# EAGLE schematic cmv12k-adapter-v1.2 (EAGLE 6.5.0)
I2C Bus Components - Dual DAC - Voltage Monitoring - Temperature Sensors - I/O Expander
VERSION: V1.2

## Sheet 1 of 3
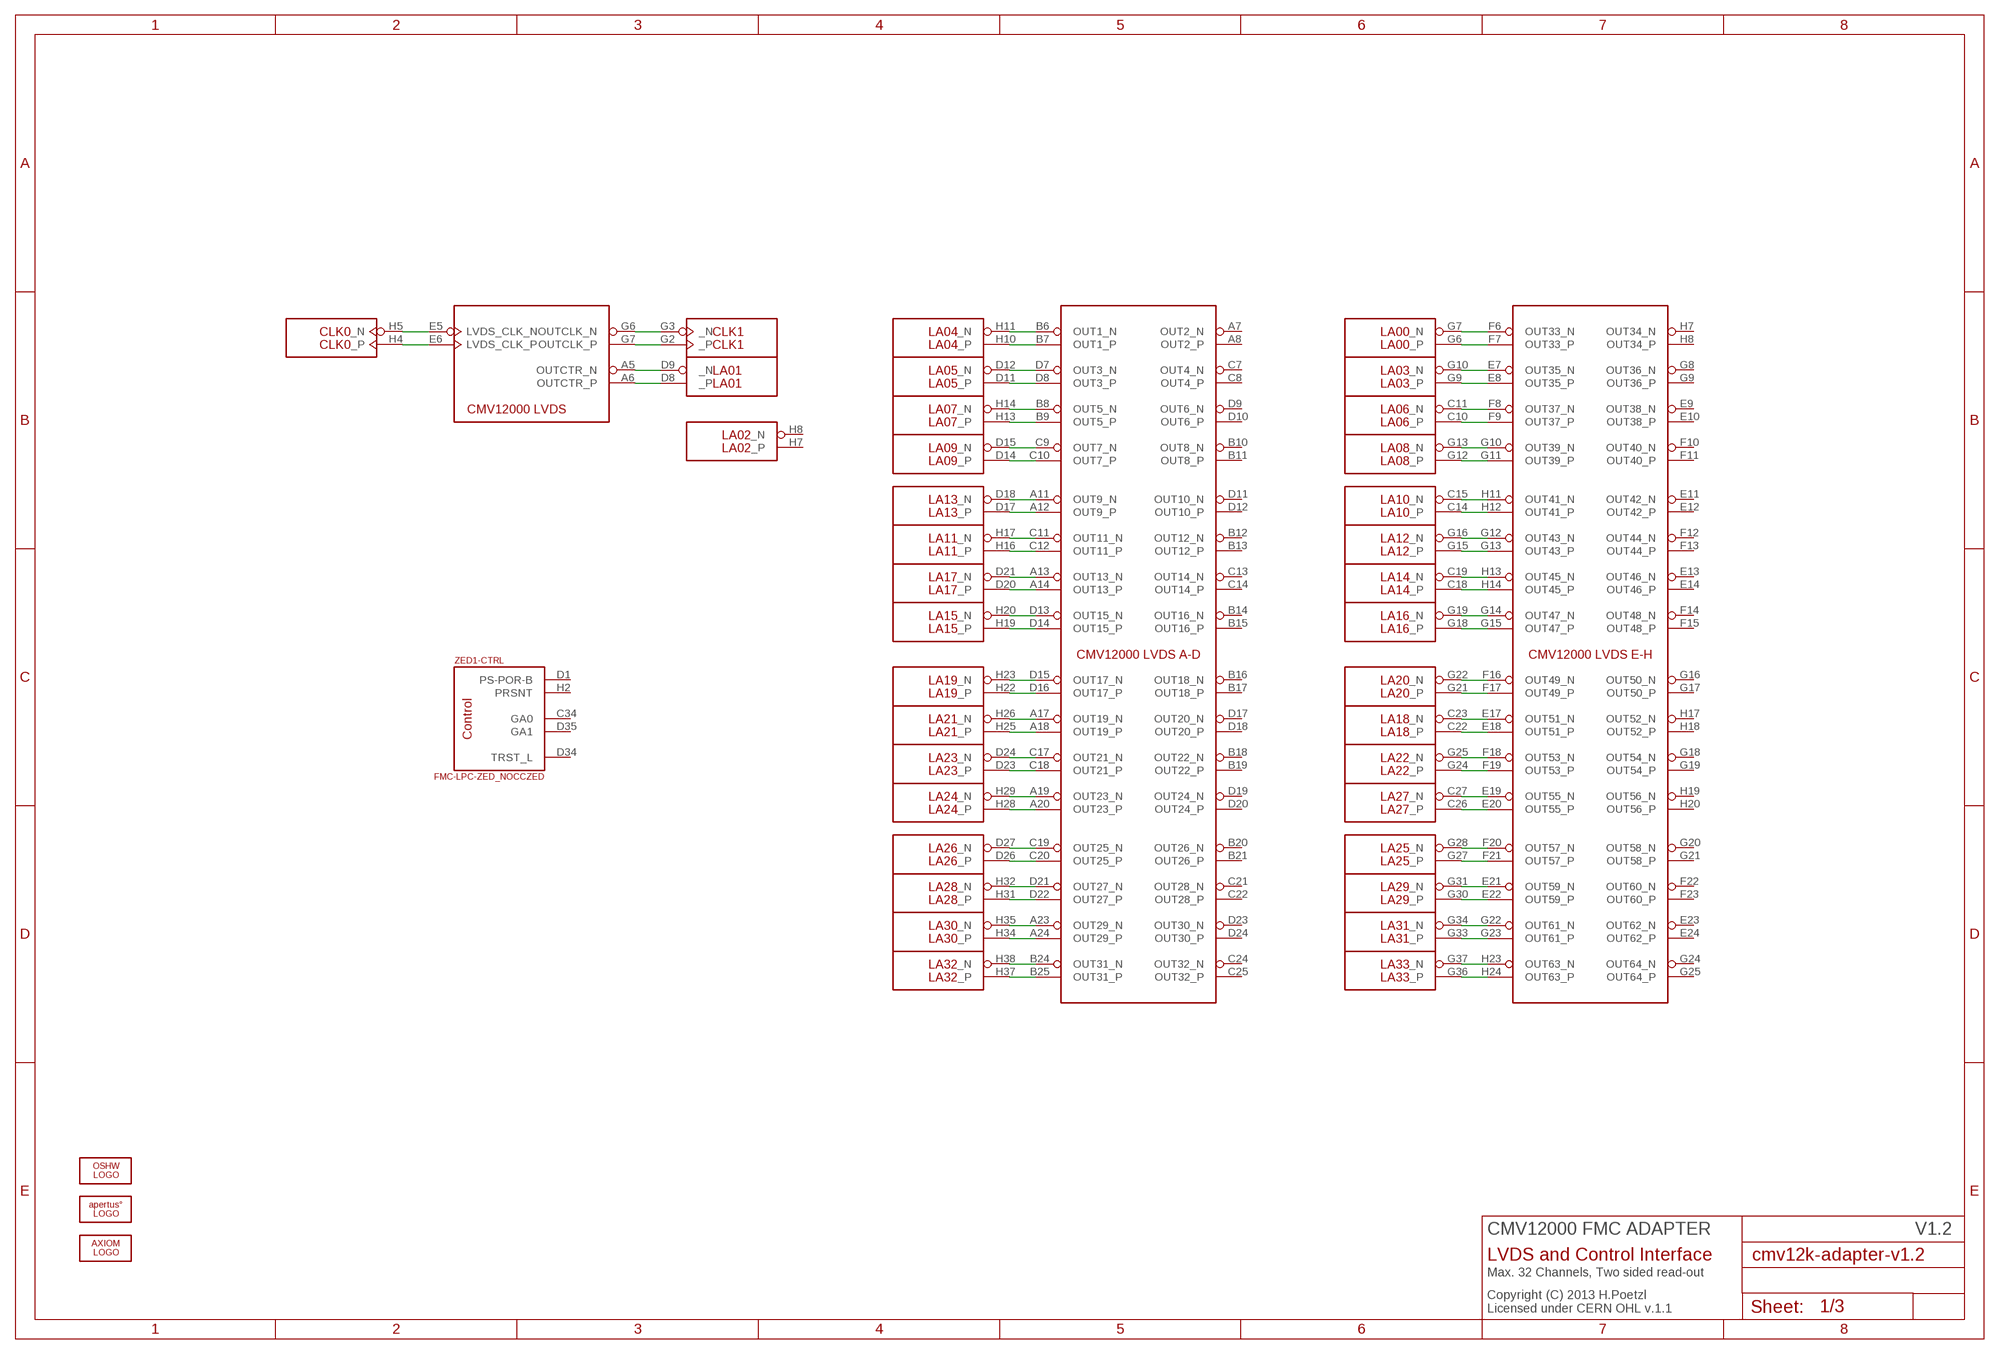
[diagram p0: schematic, sheet 1]

### Parts
LOGO1  OSHW_LOGO_FILLX0100-NT  [OSHW_FILLX100_NOTEXT]
SOCKET  CMV12000ANDON+LM  [10-30-07-237-400T4+LM]
U$5  APERTUS_LOGO334X100  [APERTUS_LOGO_334X100]
U$13  AXIOM_LOGO525X80  [AXIOM_LOGO_525X80]
ZED1  FMC-LPC-ZED_NOCCZED  [ASP-134604-01-ZED]

### Nets
CLK0_N: SOCKET.E5(LVDS_CLK_N) ZED1.H5(CLK0:_N)
CLK0_P: SOCKET.E6(LVDS_CLK_P) ZED1.H4(CLK0:_P)
CLK1_N: SOCKET.G6(OUTCLK_N) ZED1.G3(CLK1:_N)
CLK1_P: SOCKET.G7(OUTCLK_P) ZED1.G2(CLK1:_P)
LA00_N: SOCKET.F6(OUT33_N) ZED1.G7(LA00:_N)
LA00_P: SOCKET.F7(OUT33_P) ZED1.G6(LA00:_P)
LA01_N: SOCKET.A5(OUTCTR_N) ZED1.D9(LA01:_N)
LA01_P: SOCKET.A6(OUTCTR_P) ZED1.D8(LA01:_P)
LA03_N: SOCKET.E7(OUT35_N) ZED1.G10(LA03:_N)
LA03_P: SOCKET.E8(OUT35_P) ZED1.G9(LA03:_P)
LA04_N: SOCKET.B6(OUT1_N) ZED1.H11(LA04:_N)
LA04_P: SOCKET.B7(OUT1_P) ZED1.H10(LA04:_P)
LA05_N: SOCKET.D7(OUT3_N) ZED1.D12(LA05:_N)
LA05_P: SOCKET.D8(OUT3_P) ZED1.D11(LA05:_P)
LA06_N: SOCKET.F8(OUT37_N) ZED1.C11(LA06:_N)
LA06_P: SOCKET.F9(OUT37_P) ZED1.C10(LA06:_P)
LA07_N: SOCKET.B8(OUT5_N) ZED1.H14(LA07:_N)
LA07_P: SOCKET.B9(OUT5_P) ZED1.H13(LA07:_P)
LA08_N: SOCKET.G10(OUT39_N) ZED1.G13(LA08:_N)
LA08_P: SOCKET.G11(OUT39_P) ZED1.G12(LA08:_P)
LA09_N: SOCKET.C9(OUT7_N) ZED1.D15(LA09:_N)
LA09_P: SOCKET.C10(OUT7_P) ZED1.D14(LA09:_P)
LA10_N: SOCKET.H11(OUT41_N) ZED1.C15(LA10:_N)
LA10_P: SOCKET.H12(OUT41_P) ZED1.C14(LA10:_P)
LA11_N: SOCKET.C11(OUT11_N) ZED1.H17(LA11:_N)
LA11_P: SOCKET.C12(OUT11_P) ZED1.H16(LA11:_P)
LA12_N: SOCKET.G12(OUT43_N) ZED1.G16(LA12:_N)
LA12_P: SOCKET.G13(OUT43_P) ZED1.G15(LA12:_P)
LA13_N: SOCKET.A11(OUT9_N) ZED1.D18(LA13:_N)
LA13_P: SOCKET.A12(OUT9_P) ZED1.D17(LA13:_P)
LA14_N: SOCKET.H13(OUT45_N) ZED1.C19(LA14:_N)
LA14_P: SOCKET.H14(OUT45_P) ZED1.C18(LA14:_P)
LA15_N: SOCKET.D13(OUT15_N) ZED1.H20(LA15:_N)
LA15_P: SOCKET.D14(OUT15_P) ZED1.H19(LA15:_P)
LA16_N: SOCKET.G14(OUT47_N) ZED1.G19(LA16:_N)
LA16_P: SOCKET.G15(OUT47_P) ZED1.G18(LA16:_P)
LA17_N: SOCKET.A13(OUT13_N) ZED1.D21(LA17:_N)
LA17_P: SOCKET.A14(OUT13_P) ZED1.D20(LA17:_P)
LA18_N: SOCKET.E17(OUT51_N) ZED1.C23(LA18:_N)
LA18_P: SOCKET.E18(OUT51_P) ZED1.C22(LA18:_P)
LA19_N: SOCKET.D15(OUT17_N) ZED1.H23(LA19:_N)
LA19_P: SOCKET.D16(OUT17_P) ZED1.H22(LA19:_P)
LA20_N: SOCKET.F16(OUT49_N) ZED1.G22(LA20:_N)
LA20_P: SOCKET.F17(OUT49_P) ZED1.G21(LA20:_P)
LA21_N: SOCKET.A17(OUT19_N) ZED1.H26(LA21:_N)
LA21_P: SOCKET.A18(OUT19_P) ZED1.H25(LA21:_P)
LA22_N: SOCKET.F18(OUT53_N) ZED1.G25(LA22:_N)
LA22_P: SOCKET.F19(OUT53_P) ZED1.G24(LA22:_P)
LA23_N: SOCKET.C17(OUT21_N) ZED1.D24(LA23:_N)
LA23_P: SOCKET.C18(OUT21_P) ZED1.D23(LA23:_P)
LA24_N: SOCKET.A19(OUT23_N) ZED1.H29(LA24:_N)
LA24_P: SOCKET.A20(OUT23_P) ZED1.H28(LA24:_P)
LA25_N: SOCKET.F20(OUT57_N) ZED1.G28(LA25:_N)
LA25_P: SOCKET.F21(OUT57_P) ZED1.G27(LA25:_P)
LA26_N: SOCKET.C19(OUT25_N) ZED1.D27(LA26:_N)
LA26_P: SOCKET.C20(OUT25_P) ZED1.D26(LA26:_P)
LA27_N: SOCKET.E19(OUT55_N) ZED1.C27(LA27:_N)
LA27_P: SOCKET.E20(OUT55_P) ZED1.C26(LA27:_P)
LA28_N: SOCKET.D21(OUT27_N) ZED1.H32(LA28:_N)
LA28_P: SOCKET.D22(OUT27_P) ZED1.H31(LA28:_P)
LA29_N: SOCKET.E21(OUT59_N) ZED1.G31(LA29:_N)
LA29_P: SOCKET.E22(OUT59_P) ZED1.G30(LA29:_P)
LA30_N: SOCKET.A23(OUT29_N) ZED1.H35(LA30:_N)
LA30_P: SOCKET.A24(OUT29_P) ZED1.H34(LA30:_P)
LA31_N: SOCKET.G22(OUT61_N) ZED1.G34(LA31:_N)
LA31_P: SOCKET.G23(OUT61_P) ZED1.G33(LA31:_P)
LA32_N: SOCKET.B24(OUT31_N) ZED1.H38(LA32:_N)
LA32_P: SOCKET.B25(OUT31_P) ZED1.H37(LA32:_P)
LA33_N: SOCKET.H23(OUT63_N) ZED1.G37(LA33:_N)
LA33_P: SOCKET.H24(OUT63_P) ZED1.G36(LA33:_P)
Unconnected: SOCKET.A7(OUT2_N) SOCKET.A8(OUT2_P) SOCKET.B10(OUT8_N) SOCKET.B11(OUT8_P) SOCKET.B12(OUT12_N) SOCKET.B13(OUT12_P) SOCKET.B14(OUT16_N) SOCKET.B15(OUT16_P) SOCKET.B16(OUT18_N) SOCKET.B17(OUT18_P) SOCKET.B18(OUT22_N) SOCKET.B19(OUT22_P) SOCKET.B20(OUT26_N) SOCKET.B21(OUT26_P) SOCKET.C3(NC) SOCKET.C7(OUT4_N) SOCKET.C8(OUT4_P) SOCKET.C13(OUT14_N) SOCKET.C14(OUT14_P) SOCKET.C21(OUT28_N) SOCKET.C22(OUT28_P) SOCKET.C24(OUT32_N) SOCKET.C25(OUT32_P) SOCKET.D9(OUT6_N) SOCKET.D10(OUT6_P) SOCKET.D11(OUT10_N) SOCKET.D12(OUT10_P) SOCKET.D17(OUT20_N) SOCKET.D18(OUT20_P) SOCKET.D19(OUT24_N) SOCKET.D20(OUT24_P) SOCKET.D23(OUT30_N) SOCKET.D24(OUT30_P) SOCKET.E9(OUT38_N) SOCKET.E10(OUT38_P) SOCKET.E11(OUT42_N) SOCKET.E12(OUT42_P) SOCKET.E13(OUT46_N) SOCKET.E14(OUT46_P) SOCKET.E23(OUT62_N) SOCKET.E24(OUT62_P) SOCKET.F10(OUT40_N) SOCKET.F11(OUT40_P) SOCKET.F12(OUT44_N) SOCKET.F13(OUT44_P) SOCKET.F14(OUT48_N) SOCKET.F15(OUT48_P) SOCKET.F22(OUT60_N) SOCKET.F23(OUT60_P) SOCKET.F24(NC) SOCKET.F25(NC) SOCKET.G8(OUT36_N) SOCKET.G9(OUT36_P) SOCKET.G16(OUT50_N) SOCKET.G17(OUT50_P) SOCKET.G18(OUT54_N) SOCKET.G19(OUT54_P) SOCKET.G20(OUT58_N) SOCKET.G21(OUT58_P) SOCKET.G24(OUT64_N) SOCKET.G25(OUT64_P) SOCKET.H2(NC) SOCKET.H7(OUT34_N) SOCKET.H8(OUT34_P) SOCKET.H17(OUT52_N) SOCKET.H18(OUT52_P) SOCKET.H19(OUT56_N) SOCKET.H20(OUT56_P) ZED1.C2(-NC:C2M_P) ZED1.C3(-NC:C2M_N) ZED1.C6(-NC:M2C_P) ZED1.C7(-NC:M2C_N) ZED1.C34(-CTRL:GA0) ZED1.D1(-CTRL:PS-POR-B) ZED1.D4(-NC:CLK0-M2C_P) ZED1.D5(-NC:CLK0-M2C-N) ZED1.D29(-JTAG:TCK) ZED1.D30(-JTAG:TDI) ZED1.D31(-JTAG:TDO) ZED1.D33(-JTAG:TMS) ZED1.D34(-CTRL:TRST_L) ZED1.D35(-CTRL:GA1) ZED1.H2(-CTRL:PRSNT) ZED1.H7(LA02:_P) ZED1.H8(LA02:_N)

### Notes on the sheet
- CMV12000 FMC ADAPTER
- LVDS and Control Interface
- Max. 32 Channels, Two sided read-out
- Copyright (C) 2013 H.Poetzl
  Licensed under CERN OHL v.1.1

## Sheet 2 of 3
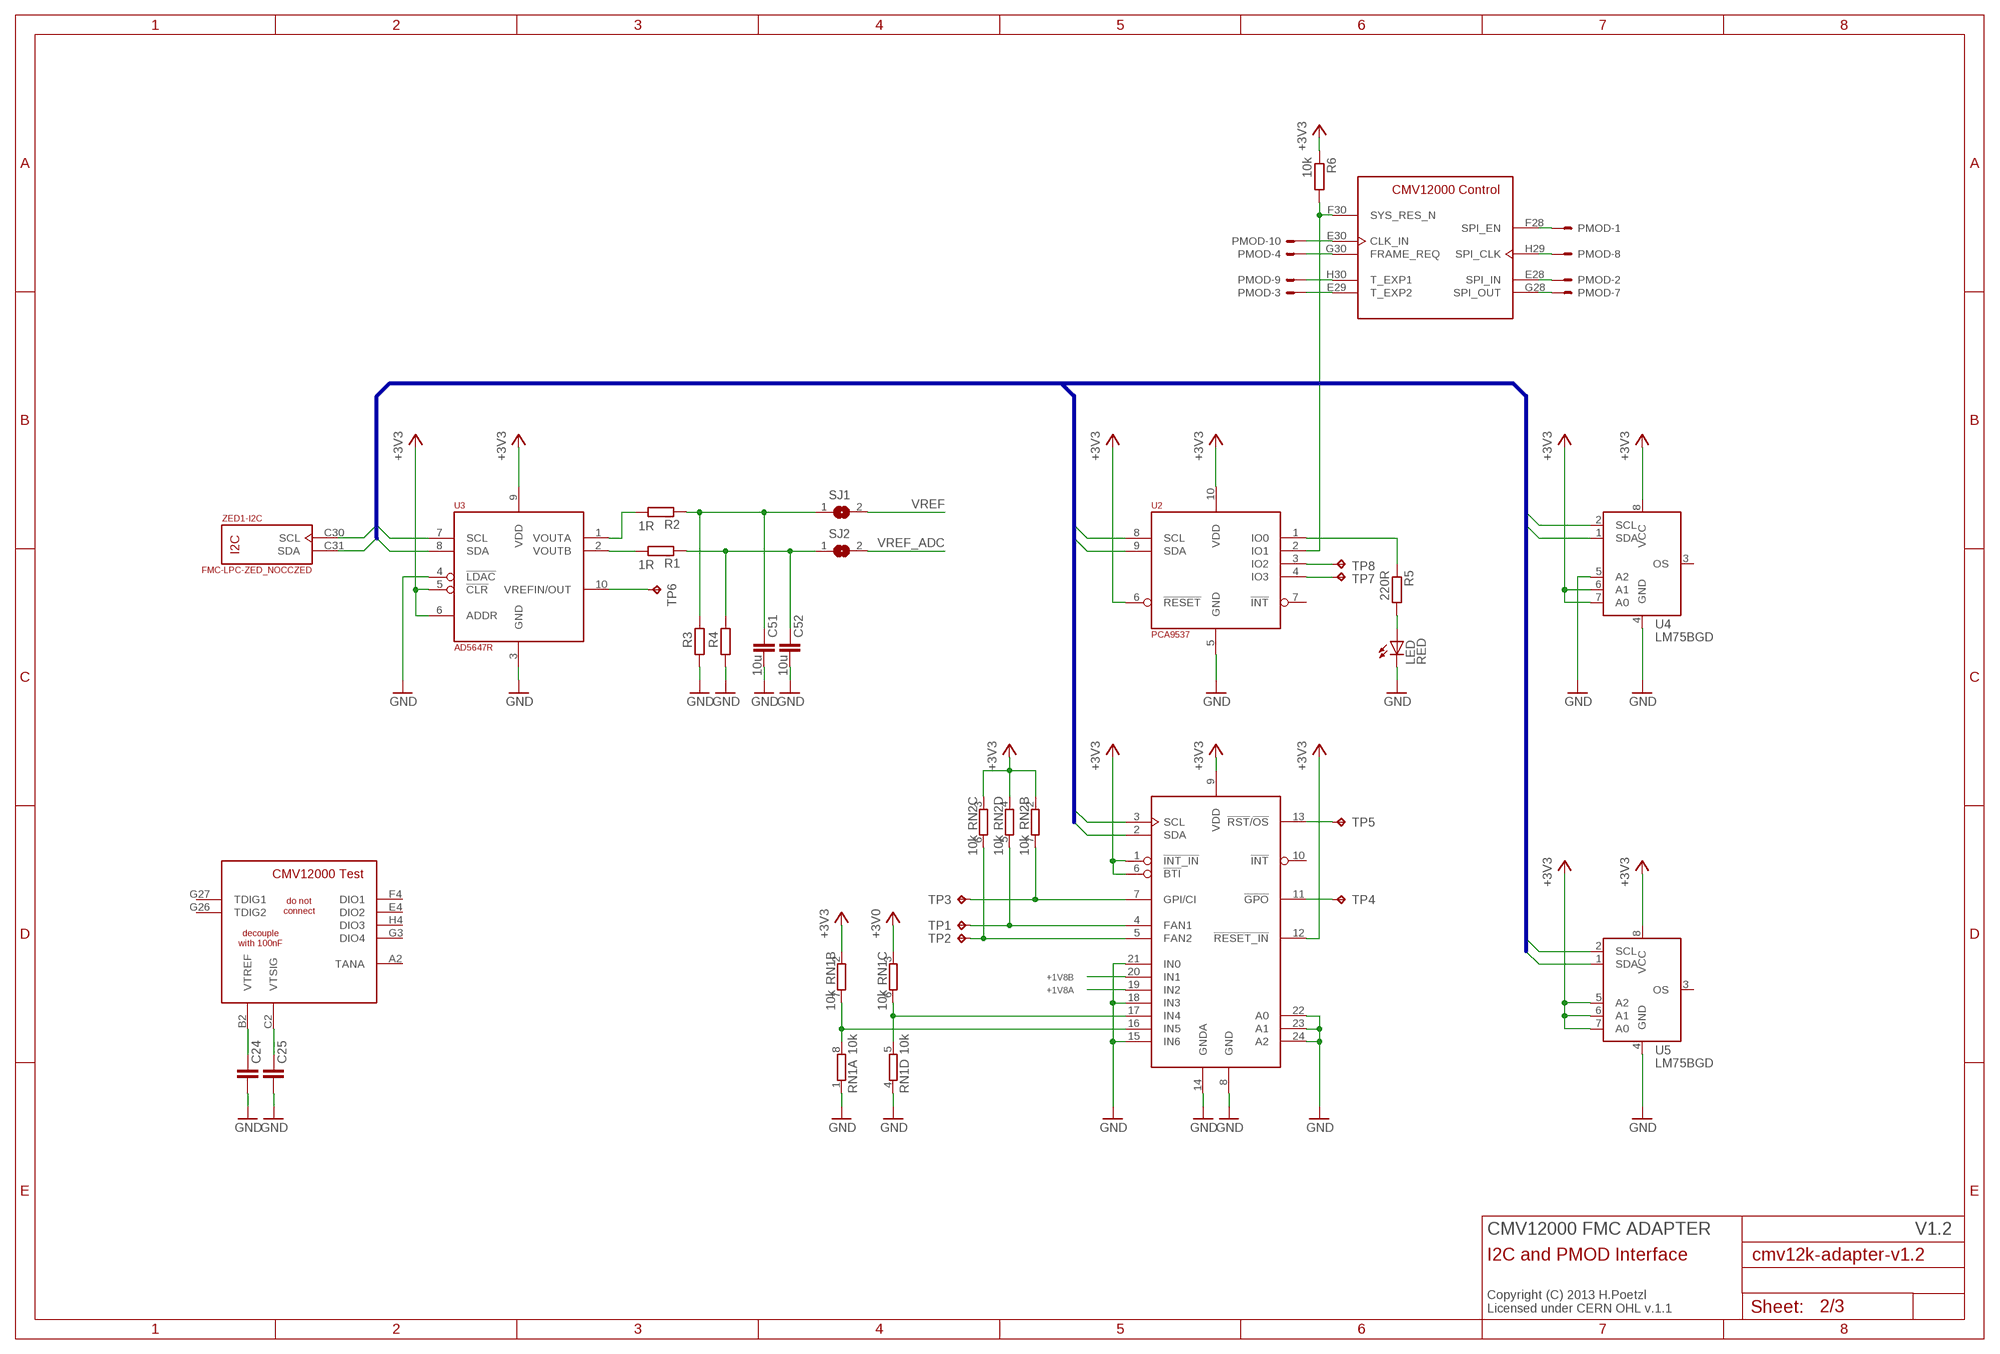
[diagram p1: schematic, sheet 2]

### Parts
C24  100n  C-EUC0402  [C0402]
C25  100n  C-EUC0402  [C0402]
C51  10u  C-EUC0603K  [C0603K]
C52  10u  C-EUC0603K  [C0603K]
LED  RED  LEDCHIP-LED0603  [CHIP-LED0603]
PMOD  PMOD-8  [2X04/90/2MM]
R1  1R  R-EU_R0402  [R0402]
R2  1R  R-EU_R0402  [R0402]
R3  R-EU_R0402  [R0402]
R4  R-EU_R0402  [R0402]
R5  220R  R-EU_R0402  [R0402]
R6  10k  R-EU_R0402  [R0402]
RN1  10k  4R-NEXBV8V  [EXBV8V]
RN2  10k  4R-NEXBV8V  [EXBV8V]
SJ1  SJ  [SJ]
SJ2  SJ  [SJ]
TP1  TPB1,27  [B1,27]
TP2  TPB1,27  [B1,27]
TP3  TPB1,27  [B1,27]
TP4  TPB1,27  [B1,27]
TP5  TPB1,27  [B1,27]
TP6  TPB1,27  [B1,27]
TP7  TPB1,27  [B1,27]
TP8  TPB1,27  [B1,27]
U1  LM96080  [TSSOP24]
U2  PCA9537  [TSSOP-10]
U3  AD5647R  [SOP50P490X110-10N]
U4  LM75BGD  [SOT996-2/3]
U5  LM75BGD  [SOT996-2/3]

### Nets
#GPO: TP4.TP U1.11(!GPO)
#RST/OS: TP5.TP U1.13(!RST!/!OS!)
+1V8A: U1.19(IN2) ; also sheet 3
+1V8B: U1.20(IN1) ; also sheet 3
+3V0: RN1.3 ; also sheet 3
+3V3: R6.1 RN1.2 RN2.2 RN2.3 RN2.4 U1.1(!INT_IN) U1.6(!BTI) U1.9(VDD) U1.12(!RESET_IN) U2.6(!RESET) U2.10(VDD) U3.5(!CLR) U3.6(ADDR) U3.9(VDD) U4.6(A1) U4.7(A0) U4.8(VCC) U5.5(A2) U5.6(A1) U5.7(A0) U5.8(VCC) ; also sheet 3
_VREF: C51.1 R2.1 R3.1 SJ1.1
_VREF_ADC: C52.1 R1.1 R4.1 SJ2.1
CLK_IN: PMOD.10 SOCKET.E30(CLK_IN)
FAN1: RN2.5 TP1.TP U1.4(FAN1)
FAN2: RN2.6 TP2.TP U1.5(FAN2)
FRAME_REQ: PMOD.4 SOCKET.G30(FRAME_REQ)
GND: C24.2 C25.2 C51.2 C52.2 LED.C R3.2 R4.2 RN1.1 RN1.4 U1.8(GND) U1.14(GNDA) U1.15(IN6) U1.18(IN3) U1.21(IN0) U1.22(A0) U1.23(A1) U1.24(A2) U2.5(GND) U3.3(GND) U3.4(!LDAC) U4.4(GND) U4.5(A2) U5.4(GND) ; also sheet 3
GPI/CI: RN2.7 TP3.TP U1.7(GPI/CI)
IN4: RN1.5 RN1.6 U1.17(IN4)
IN5: RN1.7 RN1.8 U1.16(IN5)
IO0: R5.1 U2.1(IO0)
IO1: R6.2 SOCKET.F30(SYS_RES_N) U2.2(IO1)
IO2: TP8.TP U2.3(IO2)
IO3: TP7.TP U2.4(IO3)
N$24: C24.1 SOCKET.B2(VTREF)
N$25: C25.1 SOCKET.C2(VTSIG)
N$121: LED.A R5.2
SCL: U1.3(SCL) U2.8(SCL) U3.7(SCL) U4.2(SCL) U5.2(SCL) ZED1.C30(-I2C:SCL)
SDA: U1.2(SDA) U2.9(SDA) U3.8(SDA) U4.1(SDA) U5.1(SDA) ZED1.C31(-I2C:SDA)
SPI_CLK: PMOD.8 SOCKET.H29(SPI_CLK)
SPI_EN: PMOD.1 SOCKET.F28(SPI_EN)
SPI_IN: PMOD.2 SOCKET.E28(SPI_IN)
SPI_OUT: PMOD.7 SOCKET.G28(SPI_OUT)
T_EXP1: PMOD.9 SOCKET.H30(T_EXP1)
T_EXP2: PMOD.3 SOCKET.E29(T_EXP2)
VOUTA: R2.2 U3.1(VOUTA)
VOUTB: R1.2 U3.2(VOUTB)
VREF: SJ1.2 ; also sheet 3
VREF_ADC: SJ2.2 ; also sheet 3
VREFIN/OUT: TP6.TP U3.10(VREFIN/OUT)
Unconnected: RN2.1 RN2.8 SOCKET.A2(TANA) SOCKET.E4(DIO2) SOCKET.F4(DIO1) SOCKET.G3(DIO4) SOCKET.G26(TDIG2) SOCKET.G27(TDIG1) SOCKET.H4(DIO3) U1.10(!INT) U2.7(!INT) U4.3(OS) U5.3(OS)

### Buses
SCL,SDA

### Notes on the sheet
- CMV12000 FMC ADAPTER
- I2C and PMOD Interface
- Copyright (C) 2013 H.Poetzl
  Licensed under CERN OHL v.1.1

## Sheet 3 of 3
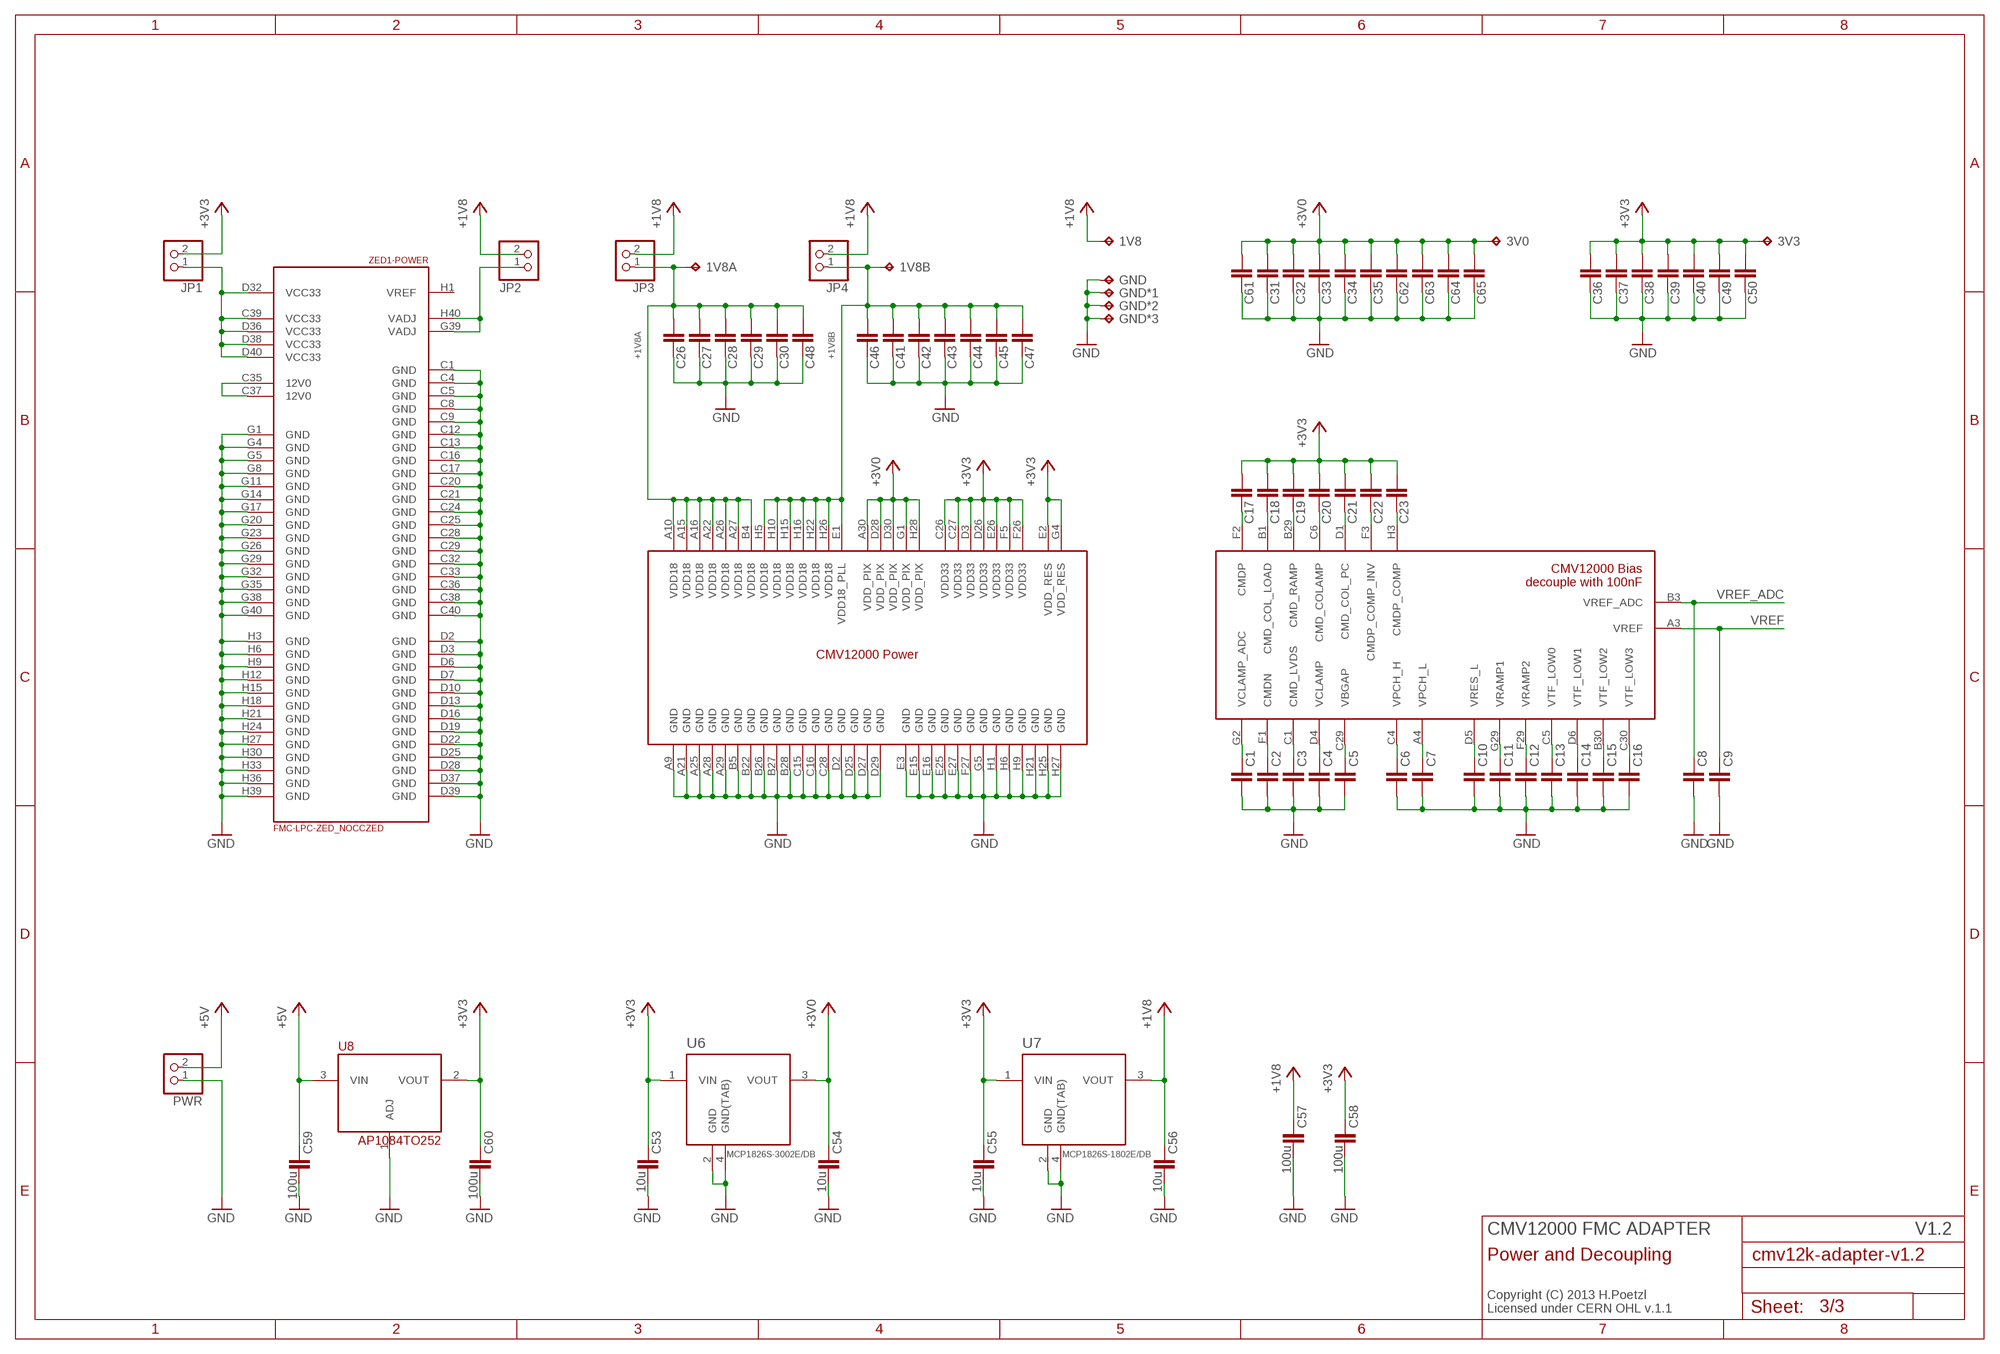
[diagram p2: schematic, sheet 3]

### Parts
1V8  TPB1,27  [B1,27]
1V8A  TPB1,27  [B1,27]
1V8B  TPB1,27  [B1,27]
3V0  TPB1,27  [B1,27]
3V3  TPB1,27  [B1,27]
C1  100n  C-EUC0402  [C0402]
C2  100n  C-EUC0402  [C0402]
C3  100n  C-EUC0402  [C0402]
C4  100n  C-EUC0402  [C0402]
C5  100n  C-EUC0402  [C0402]
C6  100n  C-EUC0402  [C0402]
C7  100n  C-EUC0402  [C0402]
C8  100n  C-EUC0402  [C0402]
C9  100n  C-EUC0402  [C0402]
C10  100n  C-EUC0402  [C0402]
C11  100n  C-EUC0402  [C0402]
C12  100n  C-EUC0402  [C0402]
C13  100n  C-EUC0402  [C0402]
C14  100n  C-EUC0402  [C0402]
C15  100n  C-EUC0402  [C0402]
C16  100n  C-EUC0402  [C0402]
C17  100n  C-EUC0402  [C0402]
C18  100n  C-EUC0402  [C0402]
C19  100n  C-EUC0402  [C0402]
C20  100n  C-EUC0402  [C0402]
C21  100n  C-EUC0402  [C0402]
C22  100n  C-EUC0402  [C0402]
C23  100n  C-EUC0402  [C0402]
C26  100n  C-EUC0402  [C0402]
C27  100n  C-EUC0402  [C0402]
C28  100n  C-EUC0402  [C0402]
C29  100n  C-EUC0402  [C0402]
C30  100n  C-EUC0402  [C0402]
C31  100n  C-EUC0402  [C0402]
C32  100n  C-EUC0402  [C0402]
C33  100n  C-EUC0402  [C0402]
C34  100n  C-EUC0402  [C0402]
C35  100n  C-EUC0402  [C0402]
C36  100n  C-EUC0402  [C0402]
C37  100n  C-EUC0402  [C0402]
C38  100n  C-EUC0402  [C0402]
C39  100n  C-EUC0402  [C0402]
C40  100n  C-EUC0402  [C0402]
C41  100n  C-EUC0402  [C0402]
C42  100n  C-EUC0402  [C0402]
C43  100n  C-EUC0402  [C0402]
C44  100n  C-EUC0402  [C0402]
C45  100n  C-EUC0402  [C0402]
C46  100n  C-EUC0402  [C0402]
C47  100n  C-EUC0402  [C0402]
C48  100n  C-EUC0402  [C0402]
C49  100n  C-EUC0402  [C0402]
C50  100n  C-EUC0402  [C0402]
C53  10u  C-EUC0603K  [C0603K]
C54  10u  C-EUC0603K  [C0603K]
C55  10u  C-EUC0603K  [C0603K]
C56  10u  C-EUC0603K  [C0603K]
C57  100u  C-EUC1210  [C1210]
C58  100u  C-EUC1210  [C1210]
C59  100u  C-EUC1210K  [C1210K]
C60  100u  C-EUC1210K  [C1210K]
C61  22µ  C-EUC0805  [C0805]
C62  4µ7  C-EUC0402  [C0402]
C63  4µ7  C-EUC0402  [C0402]
C64  4µ7  C-EUC0402  [C0402]
C65  4µ7  C-EUC0402  [C0402]
GND  TPB1,27  [B1,27]
GND*1  TPB1,27  [B1,27]
GND*2  TPB1,27  [B1,27]
GND*3  TPB1,27  [B1,27]
JP1  PINHD-1X02_2.54-S  [1X02-S]
JP2  PINHD-1X02_2.54-S  [1X02-S]
JP3  PINHD-1X02_2.54-S  [1X02-S]
JP4  PINHD-1X02_2.54-S  [1X02-S]
PWR  PINHD-1X02_2.54-S  [1X02-S]
U6  MCP1826S-3002E/DB  [SOT230P700X180-4N]
U7  MCP1826S-1802E/DB  [SOT230P700X180-4N]
U8  AP1084TO252  [TO252]

### Nets
+1V8: 1V8.TP C56.1 C57.1 JP2.2 JP3.2 JP4.2 U7.3(VOUT)
+1V8A: 1V8A.TP C26.1 C27.1 C28.1 C29.1 C30.1 C48.1 JP3.1 SOCKET.A10(VDD18) SOCKET.A15(VDD18) SOCKET.A16(VDD18) SOCKET.A22(VDD18) SOCKET.A26(VDD18) SOCKET.A27(VDD18) SOCKET.B4(VDD18) ; also sheet 2
+1V8B: 1V8B.TP C41.1 C42.1 C43.1 C44.1 C45.1 C46.1 C47.1 JP4.1 SOCKET.E1(VDD18_PLL) SOCKET.H5(VDD18) SOCKET.H10(VDD18) SOCKET.H15(VDD18) SOCKET.H16(VDD18) SOCKET.H22(VDD18) SOCKET.H26(VDD18) ; also sheet 2
+3V0: 3V0.TP C31.1 C32.1 C33.1 C34.1 C35.1 C54.1 C61.1 C62.1 C63.1 C64.1 C65.1 SOCKET.A30(VDD_PIX) SOCKET.D28(VDD_PIX) SOCKET.D30(VDD_PIX) SOCKET.G1(VDD_PIX) SOCKET.H28(VDD_PIX) U6.3(VOUT) ; also sheet 2
+3V3: 3V3.TP C17.1 C18.1 C19.1 C20.1 C21.1 C22.1 C23.1 C36.1 C37.1 C38.1 C39.1 C40.1 C49.1 C50.1 C53.1 C55.1 C58.1 C60.1 JP1.2 SOCKET.C26(VDD33) SOCKET.C27(VDD33) SOCKET.D3(VDD33) SOCKET.D26(VDD33) SOCKET.E2(VDD_RES) SOCKET.E26(VDD33) SOCKET.F5(VDD33) SOCKET.F26(VDD33) SOCKET.G4(VDD_RES) U6.1(VIN) U7.1(VIN) U8.2(VOUT) ; also sheet 2
+5V: C59.1 PWR.2 U8.3(VIN)
GND: C1.2 C2.2 C3.2 C4.2 C5.2 C6.2 C7.2 C8.2 C9.2 C10.2 C11.2 C12.2 C13.2 C14.2 C15.2 C16.2 C26.2 C27.2 C28.2 C29.2 C30.2 C31.2 C32.2 C33.2 C34.2 C35.2 C36.2 C37.2 C38.2 C39.2 C40.2 C41.2 C42.2 C43.2 C44.2 C45.2 C46.2 C47.2 C48.2 C49.2 C50.2 C53.2 C54.2 C55.2 C56.2 C57.2 C58.2 C59.2 C60.2 C61.2 C62.2 C63.2 C64.2 C65.2 GND*1.TP GND*2.TP GND*3.TP GND.TP PWR.1 SOCKET.A9(GND) SOCKET.A21(GND) SOCKET.A25(GND) SOCKET.A28(GND) SOCKET.A29(GND) SOCKET.B5(GND) SOCKET.B22(GND) SOCKET.B26(GND) SOCKET.B27(GND) SOCKET.B28(GND) SOCKET.C15(GND) SOCKET.C16(GND) SOCKET.C28(GND) SOCKET.D2(GND) SOCKET.D25(GND) SOCKET.D27(GND) SOCKET.D29(GND) SOCKET.E3(GND) SOCKET.E15(GND) SOCKET.E16(GND) SOCKET.E25(GND) SOCKET.E27(GND) SOCKET.F27(GND) SOCKET.G5(GND) SOCKET.H1(GND) SOCKET.H6(GND) SOCKET.H9(GND) SOCKET.H21(GND) SOCKET.H25(GND) SOCKET.H27(GND) U6.2(GND) U6.4(GND(TAB)) U7.2(GND) U7.4(GND(TAB)) U8.1(ADJ) ZED1.C1(-POWER:GND) ZED1.C4(-POWER:GND) ZED1.C5(-POWER:GND) ZED1.C8(-POWER:GND) ZED1.C9(-POWER:GND) ZED1.C12(-POWER:GND) ZED1.C13(-POWER:GND) ZED1.C16(-POWER:GND) ZED1.C17(-POWER:GND) ZED1.C20(-POWER:GND) ZED1.C21(-POWER:GND) ZED1.C24(-POWER:GND) ZED1.C25(-POWER:GND) ZED1.C28(-POWER:GND) ZED1.C29(-POWER:GND) ZED1.C32(-POWER:GND) ZED1.C33(-POWER:GND) ZED1.C36(-POWER:GND) ZED1.C38(-POWER:GND) ZED1.C40(-POWER:GND) ZED1.D2(-POWER:GND) ZED1.D3(-POWER:GND) ZED1.D6(-POWER:GND) ZED1.D7(-POWER:GND) ZED1.D10(-POWER:GND) ZED1.D13(-POWER:GND) ZED1.D16(-POWER:GND) ZED1.D19(-POWER:GND) ZED1.D22(-POWER:GND) ZED1.D25(-POWER:GND) ZED1.D28(-POWER:GND) ZED1.D37(-POWER:GND) ZED1.D39(-POWER:GND) ZED1.G1(-POWER:GND) ZED1.G4(-POWER:GND) ZED1.G5(-POWER:GND) ZED1.G8(-POWER:GND) ZED1.G11(-POWER:GND) ZED1.G14(-POWER:GND) ZED1.G17(-POWER:GND) ZED1.G20(-POWER:GND) ZED1.G23(-POWER:GND) ZED1.G26(-POWER:GND) ZED1.G29(-POWER:GND) ZED1.G32(-POWER:GND) ZED1.G35(-POWER:GND) ZED1.G38(-POWER:GND) ZED1.G40(-POWER:GND) ZED1.H3(-POWER:GND) ZED1.H6(-POWER:GND) ZED1.H9(-POWER:GND) ZED1.H12(-POWER:GND) ZED1.H15(-POWER:GND) ZED1.H18(-POWER:GND) ZED1.H21(-POWER:GND) ZED1.H24(-POWER:GND) ZED1.H27(-POWER:GND) ZED1.H30(-POWER:GND) ZED1.H33(-POWER:GND) ZED1.H36(-POWER:GND) ZED1.H39(-POWER:GND) ; also sheet 2
N$1: C17.2 SOCKET.F2(CMDP)
N$2: C18.2 SOCKET.B1(CMD_COL_LOAD)
N$3: C19.2 SOCKET.B29(CMD_RAMP)
N$4: C20.2 SOCKET.C6(CMD_COLAMP)
N$5: C21.2 SOCKET.D1(CMD_COL_PC)
N$6: C22.2 SOCKET.F3(CMDP_COMP_INV)
N$7: C23.2 SOCKET.H3(CMDP_COMP)
N$8: C1.1 SOCKET.G2(VCLAMP_ADC)
N$9: C2.1 SOCKET.F1(CMDN)
N$10: C3.1 SOCKET.C1(CMD_LVDS)
N$11: C4.1 SOCKET.D4(VCLAMP)
N$12: C5.1 SOCKET.C29(VBGAP)
N$13: C6.1 SOCKET.C4(VPCH_H)
N$14: C7.1 SOCKET.A4(VPCH_L)
N$17: C10.1 SOCKET.D5(VRES_L)
N$18: C11.1 SOCKET.G29(VRAMP1)
N$19: C12.1 SOCKET.F29(VRAMP2)
N$20: C13.1 SOCKET.C5(VTF_LOW0)
N$21: C14.1 SOCKET.D6(VTF_LOW1)
N$22: C15.1 SOCKET.B30(VTF_LOW2)
N$23: C16.1 SOCKET.C30(VTF_LOW3)
N$37: ZED1.C35(-POWER:12V0) ZED1.C37(-POWER:12V0)
N$38: JP1.1 ZED1.C39(-POWER:VCC33) ZED1.D32(-POWER:VCC33) ZED1.D36(-POWER:VCC33) ZED1.D38(-POWER:VCC33) ZED1.D40(-POWER:VCC33)
N$39: JP2.1 ZED1.G39(-POWER:VADJ) ZED1.H40(-POWER:VADJ)
VREF: C9.1 SOCKET.A3(VREF) ; also sheet 2
VREF_ADC: C8.1 SOCKET.B3(VREF_ADC) ; also sheet 2
Unconnected: ZED1.H1(-POWER:VREF)

### Notes on the sheet
- CMV12000 FMC ADAPTER
- Power and Decoupling
- Copyright (C) 2013 H.Poetzl
  Licensed under CERN OHL v.1.1

## Library data of the parts
1V8 1V8A 1V8B 3V0 3V3 GND GND*1-GND*3 TP1-TP8 = testpad:TP: Test pad
C1-C65 = rcl:C-EU: CAPACITOR, European symbol
JP1-JP4 PWR = pinhead-2:PINHD-1X02: PIN HEADER
LED = led:LED: LED OSRAM: - CHIPLED LG R971, LG N971, LY N971, LG Q971, LY Q971, LO R971, LY R971 LH N974, LH R974 LS Q976, LO Q976, LY Q976 LO Q996 - Hyper CHIPLED LW Q18S LB Q993, LB Q99A, LB R99A - SideLED LS A670, LO A670, LY A670, LG A670, LP A670 LB A673, LV A673, LT A673, LW A673 LH A674 LY A675 LS A676, LA A676, LO A676, LY A676, LW A676 LS A679, LY A679, LG A679 - Hyper Micro SIDELED® LS Y876, LA Y876, LO Y876, LY Y876 LT Y87S - SmartLED LW L88C, LW L88S LB L89C, LB L89S, LG L890 LS L89K, LO L89K, LY L89K LS L896, LA L896, LO L896, LY L896 - TOPLED LS T670, LO T670, LY T670, LG T670, LP T670 LSG T670, LSP T670, LSY T670, LOP T670, LYG T670 LG T671, LOG T671, LSG T671 LB T673, LV T673, LT T673, LW T673 LH T674 LS T676, LA T676, LO T676, LY T676, LB T676, LH T676, LSB T676, LW T676 LB T67C, LV T67C, LT T67C, LS T67K, LO T67K, LY T67K, LW E67C LS E67B, LA E67B, LO E67B, LY E67B, LB E67C, LV E67C, LT E67C LW T67C LS T679, LY T679, LG T679 LS T770, LO T770, LY T770, LG T770, LP T770 LB T773, LV T773, LT T773, LW T773 LH T774 LS E675, LA E675, LY E675, LS T675 LS T776, LA T776, LO T776, LY T776, LB T776 LHGB T686 LT T68C, LB T68C - Hyper Mini TOPLED® LB M676 - Mini TOPLED Santana® LG M470 LS M47K, LO M47K, LY M47K Source: http://www.osram.convergy.de LUXEON: - LUMILED® LXK2-PW12-R00, LXK2-PW12-S00, LXK2-PW14-U00, LXK2-PW14-V00 LXK2-PM12-R00, LXK2-PM12-S00, LXK2-PM14-U00 LXK2-PE12-Q00, LXK2-PE12-R00, LXK2-PE12-S00, LXK2-PE14-T00, LXK2-PE14-U00 LXK2-PB12-K00, LXK2-PB12-L00, LXK2-PB12-M00, LXK2-PB14-N00, LXK2-PB14-P00, LXK2-PB14-Q00 LXK2-PR12-L00, LXK2-PR12-M00, LXK2-PR14-Q00, LXK2-PR14-R00 LXK2-PD12-Q00, LXK2-PD12-R00, LXK2-PD12-S00 LXK2-PH12-R00, LXK2-PH12-S00 LXK2-PL12-P00, LXK2-PL12-Q00, LXK2-PL12-R00 Source: www.luxeon.com KINGBRIGHT: KA-3528ASYC Source: www.kingbright.com
LOGO1 = ohw-logo:OSHW_LOGO_FILL
PMOD = pmod:PMOD-8
R1-R6 = rcl:R-EU_: RESISTOR, European symbol
RN1 RN2 = resistor-dil:4R-N: Array Chip Resistor Source: RS Component / Phycomp
SJ1 SJ2 = jumper:SJ: SMD solder JUMPER
SOCKET = andon-cmosis:CMV12000
U1 = lm96080:LM96080
U2 = pca9537:PCA9537: 12-/14-/16-Bit nano Digital-to-Analog Converter; MPN: AD5647RBRMZ; OC_FARNELL: 1498712; OC_NEWARK: 15P0707; PACKAGE: MSOP-10; SUPPLIER: Analog Devices
U3 = ad5647:AD5647R: 12-/14-/16-Bit nano Digital-to-Analog Converter; MPN: AD5647RBRMZ; OC_FARNELL: 1498712; OC_NEWARK: 15P0707; PACKAGE: MSOP-10; SUPPLIER: Analog Devices
U4 U5 = nxp_60:LM75B: Digital temperature sensor and thermal watchdog AAL Eindhoven MK
U6 = mcp1826s:MCP1826S-3002E/DB: IC, LDO, 3.0V, 1A; MPN: MCP1826S-3002E/DB; OC_FARNELL: 1578422; OC_NEWARK: 27M0034; PACKAGE: SOT-223-3; SUPPLIER: Microchip
U7 = mcp1826s:MCP1826S-1802E/DB: IC, LDO VOLT REG, 1.8V, 1A,; MPN: MCP1826S-1802E/DB; OC_FARNELL: 1578419; OC_NEWARK: 27M0028; PACKAGE: SOT-223-3; SUPPLIER: Microchip
U8 = ap1084:AP1084
U$5 = logos_apertus_axiom:APERTUS_LOGO
U$13 = logos_apertus_axiom:AXIOM_LOGO
ZED1 = fmc-lpc:FMC-LPC-ZED_NOCC